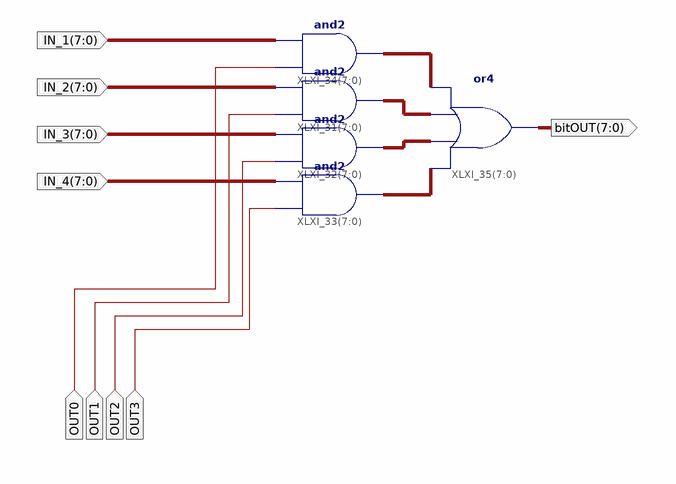
[diagram p0: schematic sheet 1]
// Xilinx ISE schematic Mux16.sch (spartan6) as structural Verilog: 5 symbols, 9 ports
module Mux16 (
  input  OUT1,
  input  OUT2,
  input  OUT3,
  input  [7:0] IN_1,
  input  [7:0] IN_2,
  input  [7:0] IN_3,
  input  [7:0] IN_4,
  input  OUT0,
  output [7:0] bitOUT
);

  wire [7:0] XLXN_141, XLXN_142, XLXN_143, XLXN_144;

  assign XLXN_142 = {8{OUT1}} & IN_2;  // and2 XLXI_31[7..0], 8 bits wide
  assign XLXN_143 = {8{OUT2}} & IN_3;  // and2 XLXI_32[7..0], 8 bits wide
  assign XLXN_144 = {8{OUT3}} & IN_4;  // and2 XLXI_33[7..0], 8 bits wide
  assign XLXN_141 = {8{OUT0}} & IN_1;  // and2 XLXI_34[7..0], 8 bits wide
  assign bitOUT = XLXN_144 | XLXN_143 | XLXN_142 | XLXN_141;  // or4 XLXI_35[7..0], 8 bits wide
endmodule
